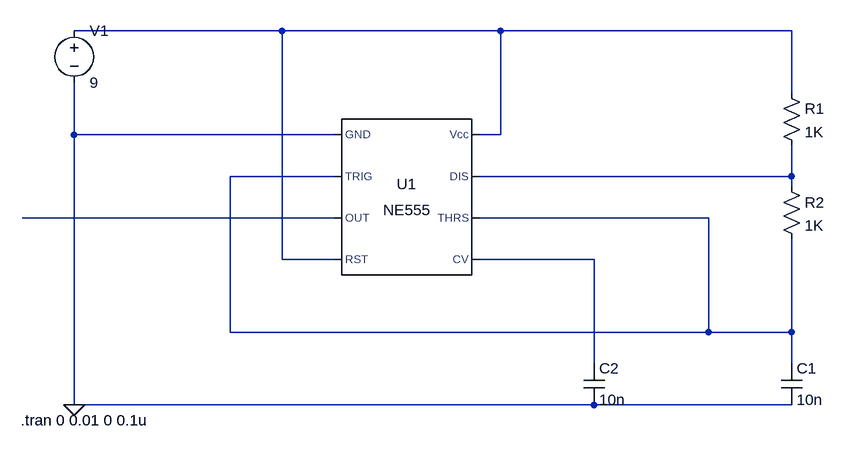
[diagram p0: schematic Draft3.asc]
Draft3.asc, the LTspice schematic file:
Version 4
SHEET 1 880 680
WIRE -64 -288 -384 -288
WIRE 272 -288 -64 -288
WIRE 720 -288 272 -288
WIRE 720 -192 720 -288
WIRE -384 -128 -384 -208
WIRE 16 -128 -384 -128
WIRE 272 -128 272 -288
WIRE 272 -128 240 -128
WIRE 16 -64 -144 -64
WIRE 720 -64 720 -112
WIRE 720 -64 240 -64
WIRE 720 -48 720 -64
WIRE 16 0 -464 0
WIRE 592 0 240 0
WIRE -64 64 -64 -288
WIRE 16 64 -64 64
WIRE 416 64 240 64
WIRE -144 176 -144 -64
WIRE 592 176 592 0
WIRE 592 176 -144 176
WIRE 720 176 720 32
WIRE 720 176 592 176
WIRE 416 224 416 64
WIRE 720 224 720 176
WIRE -384 288 -384 -128
WIRE 416 288 -384 288
WIRE 720 288 416 288
FLAG -384 288 0
SYMBOL Misc\\NE555 128 -32 R0
SYMATTR InstName U1
SYMBOL voltage -384 -304 R0
WINDOW 123 0 0 Left 0
WINDOW 39 0 0 Left 0
SYMATTR InstName V1
SYMATTR Value 9
SYMBOL res 704 -64 R0
SYMATTR InstName R2
SYMATTR Value 1K
SYMBOL res 704 -208 R0
SYMATTR InstName R1
SYMATTR Value 1K
SYMBOL cap 704 224 R0
SYMATTR InstName C1
SYMATTR Value 10n
SYMBOL cap 400 224 R0
SYMATTR InstName C2
SYMATTR Value 10n
TEXT -466 312 Left 2 !.tran 0 0.01 0 0.1u

The netlist it stands for:
* Draft3.asc
XU1 0 N002 N004 N001 N005 N002 N003 N001 NE555  ; pins GND TRIG OUT RST CV THRS DIS Vcc
V1 N001 0 9
R2 N003 N002 1K
R1 N001 N003 1K
C1 N002 0 10n
C2 N005 0 10n
.tran 0 0.01 0 0.1u
.lib NE555.sub
.backanno
.end